# EAGLE schematic isl-test (EAGLE 6.1)
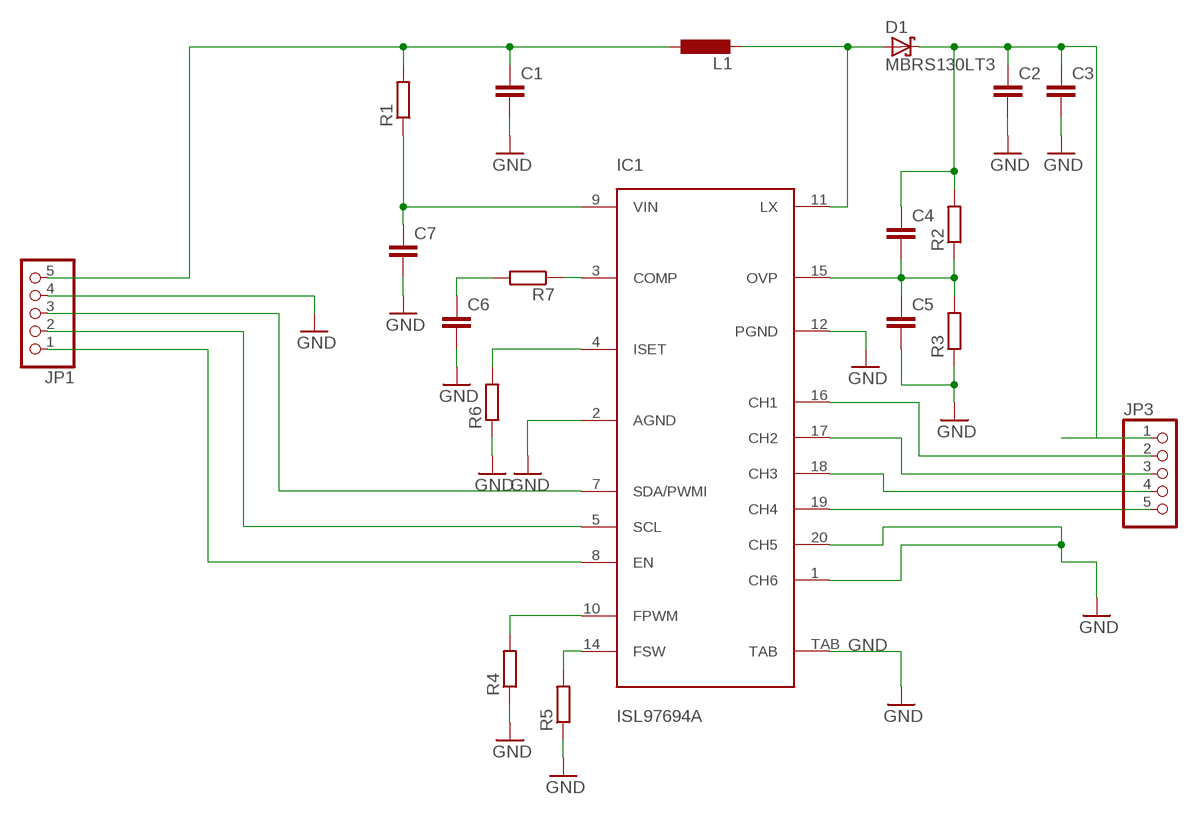
[diagram p0: schematic, sheet 1]

## Parts
C1  C-EUC0805  [C0805]
C2  C-EUC0805  [C0805]
C3  C-EUC0805  [C0805]
C4  C-EUC0603  [C0603]
C5  C-EUC0603  [C0603]
C6  C-EUC0603  [C0603]
C7  C-EUC0603  [C0603]
D1  MBRS130LT3  [SMB]
IC1  ISL97694A  [TQFN-20]
JP1  PINHD-1X5  [1X05]
JP3  PINHD-1X5  [1X05]
L1  L-EUL1812  [L1812]
R1  R-EU_R0603  [R0603]
R2  R-EU_R0603  [R0603]
R3  R-EU_R0603  [R0603]
R4  R-EU_R0603  [R0603]
R5  R-EU_R0603  [R0603]
R6  R-EU_R0603  [R0603]
R7  R-EU_R0603  [R0603]

## Nets
GND: C1.2 C2.2 C3.2 C5.2 C6.2 C7.2 IC1.1(CH6) IC1.2(AGND) IC1.12(PGND) IC1.20(CH5) IC1.TAB JP1.4 R3.1 R4.1 R5.1 R6.1
N$2: C1.1 JP1.5 L1.1 R1.2
N$3: D1.A IC1.11(LX) L1.2
N$5: C4.2 C5.1 IC1.15(OVP) R2.1 R3.2
N$6: C2.1 C3.1 C4.1 D1.C JP3.1 R2.2
N$8: IC1.3(COMP) R7.1
N$9: C6.1 R7.2
N$11: IC1.4(ISET) R6.2
N$12: IC1.10(FPWM) R4.2
N$13: IC1.14(FSW) R5.2
N$14: IC1.8(EN) JP1.1
N$15: IC1.5(SCL) JP1.2
N$16: IC1.7(SDA/PWMI) JP1.3
N$21: IC1.16(CH1) JP3.2
N$22: IC1.17(CH2) JP3.3
N$23: IC1.18(CH3) JP3.4
N$24: IC1.19(CH4) JP3.5
VIN: C7.1 IC1.9(VIN) R1.1

## Library data of the parts
C1-C7 = rcl:C-EU: CAPACITOR, European symbol
D1 = diode:MBRS130LT3: Schottky Power Rectifier Source: http://www.onsemi.com/pub/Collateral/MBRS130LT3-D.PDF
IC1 = xtort:ISL97694A
JP1 JP3 = pinhead:PINHD-1X5: PIN HEADER
L1 = rcl:L-EU: INDUCTOR, European symbol
R1-R7 = rcl:R-EU_: RESISTOR, European symbol